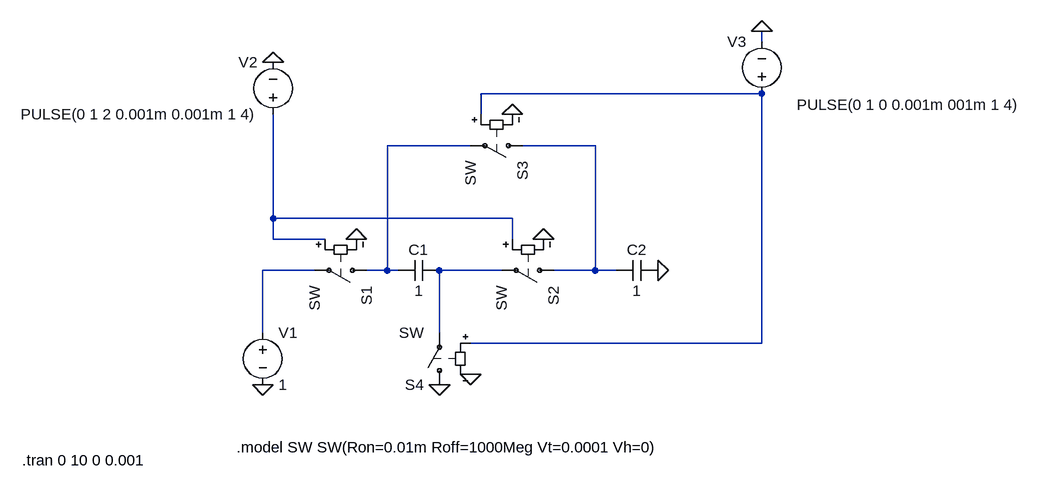
[diagram p0: schematic test.asc]
test.asc, the LTspice schematic file:
Version 4
SHEET 1 1152 680
WIRE 752 -288 752 -304
WIRE 752 -208 320 -208
WIRE 320 -176 320 -208
WIRE 304 -128 176 -128
WIRE 496 -128 384 -128
WIRE 0 -16 0 -176
WIRE 368 -16 0 -16
WIRE 0 16 0 -16
WIRE 80 16 0 16
WIRE 368 16 368 -16
WIRE 64 64 -16 64
WIRE 176 64 176 -128
WIRE 176 64 144 64
WIRE 192 64 176 64
WIRE 352 64 256 64
WIRE 496 64 496 -128
WIRE 496 64 432 64
WIRE 528 64 496 64
WIRE -16 160 -16 64
WIRE 256 160 256 64
WIRE 752 176 752 -208
WIRE 752 176 304 176
FLAG -16 240 0
FLAG 368 -176 0
FLAG 128 16 0
FLAG 416 16 0
FLAG 304 224 0
FLAG 592 64 0
FLAG 256 240 0
FLAG 0 -256 0
FLAG 752 -304 0
SYMBOL voltage -16 144 R0
WINDOW 123 0 0 Left 2
WINDOW 39 0 0 Left 2
SYMATTR InstName V1
SYMATTR Value 1
SYMBOL cap 256 48 R90
WINDOW 0 0 32 VBottom 2
WINDOW 3 32 32 VTop 2
SYMATTR InstName C1
SYMATTR Value 1
SYMBOL cap 592 48 R90
WINDOW 0 0 32 VBottom 2
WINDOW 3 32 32 VTop 2
SYMATTR InstName C2
SYMATTR Value 1
SYMBOL sw 160 64 R90
SYMATTR InstName S1
SYMBOL sw 448 64 R90
SYMATTR InstName S2
SYMBOL sw 400 -128 R90
SYMATTR InstName S3
SYMBOL sw 256 256 R180
SYMATTR InstName S4
SYMBOL voltage 0 -160 R180
WINDOW 0 24 96 Left 2
WINDOW 3 24 16 Left 2
WINDOW 123 0 0 Left 2
WINDOW 39 0 0 Left 2
SYMATTR InstName V2
SYMATTR Value PULSE(0 1 2 0.001m 0.001m 1 4)
SYMBOL voltage 752 -192 R180
WINDOW 0 24 96 Left 2
WINDOW 3 -398 -1 Left 2
WINDOW 123 0 0 Left 2
WINDOW 39 0 0 Left 2
SYMATTR InstName V3
SYMATTR Value PULSE(0 1 0 0.001m 001m 1 4)
TEXT -56 336 Left 2 !.model SW SW(Ron=0.01m Roff=1000Meg Vt=0.0001 Vh=0)
TEXT -386 356 Left 2 !.tran 0 10 0 0.001

The netlist it stands for:
* test.asc
V1 N005 0 1
C1 N006 N002 1
C2 0 N003 1
S1 N002 N005 N004 0 SW
S2 N003 N006 N004 0 SW
S3 N003 N002 N001 0 SW
S4 0 N006 N001 0 SW
V2 N004 0 PULSE(0 1 2 0.001m 0.001m 1 4)
V3 N001 0 PULSE(0 1 0 0.001m 001m 1 4)
.model SW SW(Ron=0.01m Roff=1000Meg Vt=0.0001 Vh=0)
.tran 0 10 0 0.001
.backanno
.end